# Altium schematic sheet touchscreen.SchDoc
size A
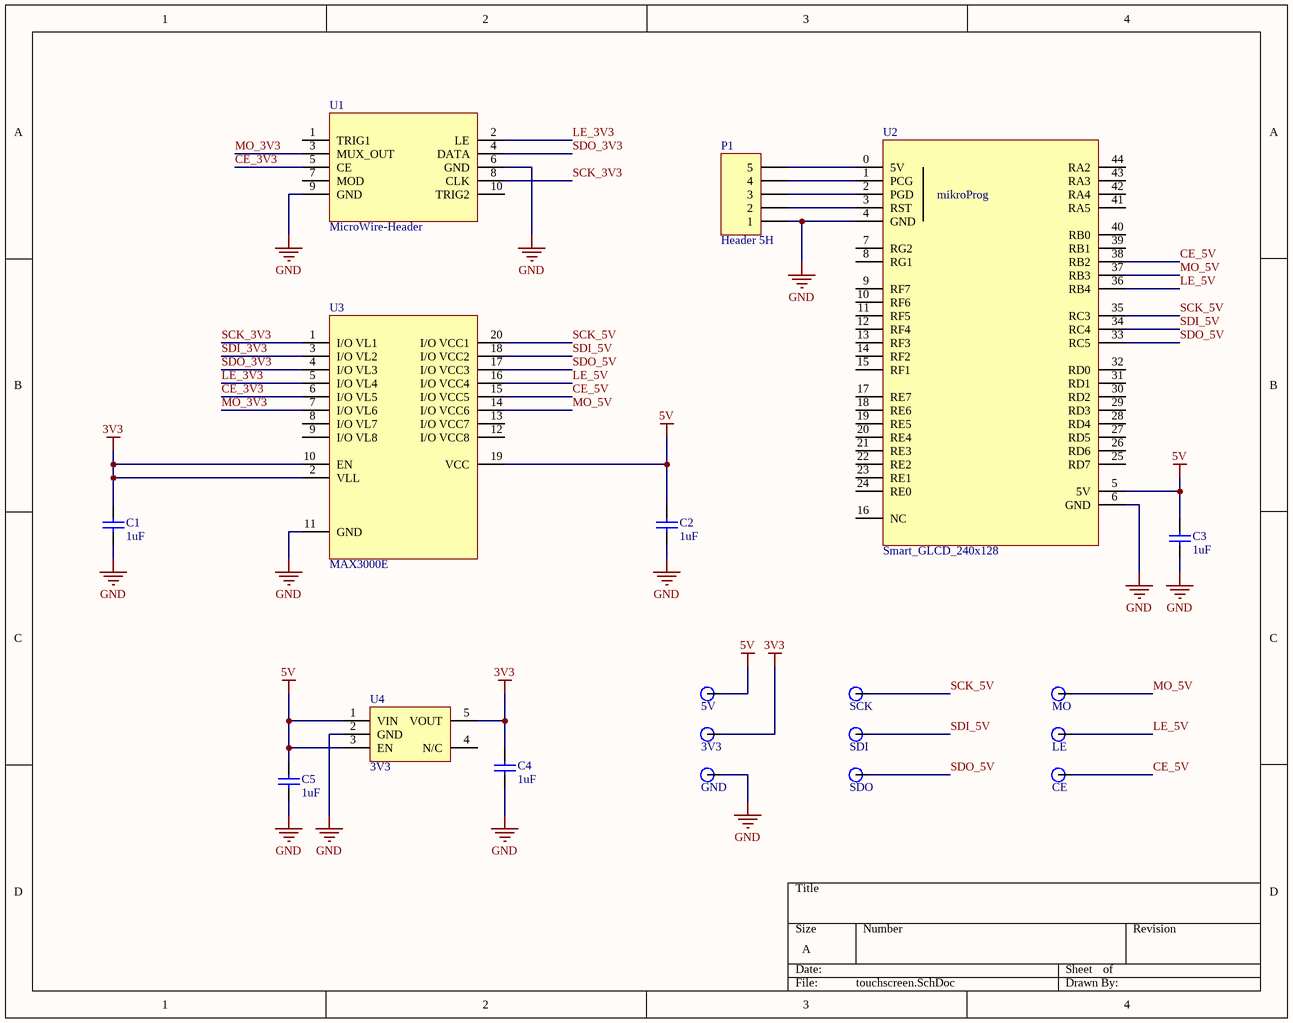
[diagram p0: touchscreen.SchDoc]

## Parts
3V3  TP-LOOP  [TP-LOOP]  (value not drawn)
5V  TP-LOOP  [TP-LOOP]  (value not drawn)
C1  1uF  [0603-0.8MM]
C2  1uF  [0603-0.8MM]
C3  1uF  [0603-0.8MM]
C4  1uF  [0603-0.8MM]
C5  1uF  [0603-0.8MM]
CE  TP-LOOP  [TP-LOOP]  (value not drawn)
GND  TP-LOOP  [TP-LOOP]  (value not drawn)
LE  TP-LOOP  [TP-LOOP]  (value not drawn)
MO  TP-LOOP  [TP-LOOP]  (value not drawn)
P1  Header 5H  [HDR1X5H]
SCK  TP-LOOP  [TP-LOOP]  (value not drawn)
SDI  TP-LOOP  [TP-LOOP]  (value not drawn)
SDO  TP-LOOP  [TP-LOOP]  (value not drawn)
U1  MicroWire-Header  [HDR2x5]
U2  Smart_GLCD_240x128  [GLCD_PANEL]
U3  MAX3000E  [TSSOP20]
U4  3V3  [SOT-23-5]

## Nets
3V3: 3V3.0 C1.2 C4.2 U3.2(VLL) U3.10(EN) U4.5(VOUT)
5V: 5V.0 C2.2 C3.2 C5.2 U2.5(5V) U3.19(VCC) U4.1(VIN) U4.3(EN)
GND: C1.1 C2.1 C3.1 C4.1 C5.1 GND.0 P1.1 U1.6(GND) U1.9(GND) U2.4(GND) U2.6(GND) U3.11(GND) U4.2(GND)
CE_3V3: U1.5(CE) U3.6(I/O_VL5)
CE_5V: CE.0 U2.38(RB2) U3.15(I/O_VCC5)
LE_3V3: U1.2(LE) U3.5(I/O_VL4)
LE_5V: LE.0 U2.36(RB4) U3.16(I/O_VCC4)
MO_3V3: U1.3(MUX_OUT) U3.7(I/O_VL6)
MO_5V: MO.0 U2.37(RB3) U3.14(I/O_VCC6)
SCK_3V3: U1.8(CLK) U3.1(I/O_VL1)
SCK_5V: SCK.0 U2.35(RC3) U3.20(I/O_VCC1)
SDI_3V3: U3.3(I/O_VL2)
SDI_5V: SDI.0 U2.34(RC4) U3.18(I/O_VCC2)
SDO_3V3: U1.4(DATA) U3.4(I/O_VL3)
SDO_5V: SDO.0 U2.33(RC5) U3.17(I/O_VCC3)
NetP1_2: P1.2 U2.3(RST)
NetP1_3: P1.3 U2.2(PGD)
NetP1_4: P1.4 U2.1(PCG)
NetP1_5: P1.5 U2.0(5V)

Not connected (* = marked no-connect by the designer): U1 1(TRIG1) 7(MOD) 10(TRIG2); U2 7(RG2) 8(RG1) 9(RF7) 10(RF6) 11(RF5) 12(RF4) 13(RF3) 14(RF2) 15(RF1) 16(NC) 17(RE7) 18(RE6) 19(RE5) 20(RE4) 21(RE3) 22(RE2) 23(RE1) 24(RE0) 25(RD7) 26(RD6) 27(RD5) 28(RD4) 29(RD3) 30(RD2) 31(RD1) 32(RD0) 39(RB1) 40(RB0) 41(RA5) 42(RA4) 43(RA3) 44(RA2); U3 8(I/O_VL7) 9(I/O_VL8) 12(I/O_VCC8) 13(I/O_VCC7); U4 4(N/C)

## Notes on the sheet
- (in symbol MISCP-00001) mikroProg

## Library data of the parts
3V3 5V = TP-00001: Part Description: Red Test Loop; Manufacturer: Keystone Electronics; Mfg Part Num: 5000; Part Number: TP-00001; Value: TP-LOOP; Pins: 1; Supplier 1: Mouser; Supplier Part Num 1: 534-5000; Supplier Link 1: http://www.mouser.com/ProductDetail/Keystone-Electronics/5000/?qs=sGAEpiMZZMtzcnMBgC2bs9AdrKY7Wm7fC3CU8Xg0kAY%3d
C1-C5 = CAP-00003: Capacitor; Part Description: CAP CER 1UF 50V 10% X7R 0603; Manufacturer: Taiyo Yuden; Mfg Part Num: UMK107AB7105KA-T; Voltage: 50V; Temperature Rating (C): 125; PackageDescription: Chip Capacitor; Part Number: CAP-00003; Value: 1uF; Datasheet Link: http://www.digikey.com/product-detail/en/UMK107AB7105KA-T/587-3247-1-ND/3660107; Supplier 1: Digi-Key; Supplier Part Num 1: 587-3247-1-ND; Supplier Link 1: http://www.digikey.com/product-detail/en/UMK107AB7105KA-T/587-3247-1-ND/3660107
CE LE MO SCK SDI SDO = TP-00005: Part Description: Yellow Test Loop; Manufacturer: Keystone Electronics; Mfg Part Num: 5004; Part Number: TP-00005; Value: TP-LOOP; Pins: 1; Supplier 1: Mouser; Supplier Part Num 1: 534-5004; Supplier Link 1: http://www.mouser.com/ProductDetail/Keystone-Electronics/5004/?qs=%2fha2pyFaduhjVE6EQorYz%252bLTusWZAa7R0fi5DgNOeBY%3d
GND = TP-00002: Part Description: Black Test Loop; Manufacturer: Keystone Electronics; Mfg Part Num: 5001; Part Number: TP-00002; Value: TP-LOOP; Pins: 1; Supplier 1: Digi-Key; Supplier Part Num 1: 5001K-ND; Supplier Link 1: http://www.digikey.com/product-search/en?x=27&y=11&lang=en&site=us&keywords=5001K-ND; Supplier 2: Mouser; Supplier Part Num 2: 534-5001; Supplier Link 2: http://www.mouser.com/ProductDetail/Keystone-Electronics/5001/?qs=%2fha2pyFadugenAX7QbWVFH4SHo0ei47vvMiPqT82XGoPZE5igKcT0vifsSD7Qb20
P1 = CON-00002: Header, 5-Pin, Right Angle; Part Description: 5-Pin 0.1" Right Angle Header; Manufacturer: 3M; Value: 961105-5604-AR; LatestRevisionDate: 17-Jul-2002; LatestRevisionNote: Re-released for DXP Platform.; Publisher: Altium Limited; Part Number: CON-00002; Pins: 5; Mfg Part Num: 961105-5604-AR; Supplier 1: Digi-Key; Supplier Part Num 1: 3M9470-ND
U1 = CON-00001: Part Description: 100 Mil Pitch 2X5 Shrouded Header; Manufacturer: FCI; Mfg Part Num: 52601-G10-8LF; Value: NA; Part Number: CON-00001; Pins: 10; Supplier 1: Digikey; Supplier Part Num 1: 609-3596-ND; Supplier Link 1: http://www.digikey.com/product-detail/en/52601-G10-8LF/609-3596-ND/1487644
U2 = MISCP-00001: Part Description: GLCD Touchscreen Panel; Manufacturer: Mikroelektronika; Mfg Part Num: Smart GLCD 240x128; Value: NA; Voltage: 5; Part Number: MISCP-00001; Operating Temp (°C): NA; Datasheet Link: http://www.mikroe.com/smartglcd/
U3 = MISC-00001: Part Description: Bidirectional 8-Channel Logic Translator; Manufacturer: Maxim Integrated; Mfg Part Num: MAX3000EEUP+; Voltage: 1.65V - 5.5V; Interface: NA; Part Number: MISC-00001; Value: MAX3000E; Operating Temp (°C): 85; Package: 20-TSSOP; Datasheet Link: http://datasheets.maximintegrated.com/en/ds/MAX3000E-MAX3012.pdf; Supplier 1: Digikey; Supplier Part Num 1: MAX3000EEUP+-ND; Supplier Link 1: http://www.digikey.com/product-detail/en/MAX3000EEUP%2B/MAX3000EEUP%2B-ND/1512964
U4 = VREG-00002: Part Description: IC REG LDO 3.3V 0.3A SOT23-5; Manufacturer: TI; Value: TLV70233; Input Voltage: 2.0-5.5V; Fixed/Adjustable: Fixed; Output Voltage: 3.3V; Part Number: VREG-00002; Type: Linear; Operating Temp (°C): 125; Mfg Part Num: TLV70233DBVR; Datasheet Link: http://www.ti.com/lit/ds/symlink/tlv70225.pdf; Supplier 1: Digi-Key; Supplier Part Num 1: 296-32415-1-ND; Supplier Link 1: http://www.digikey.com/product-detail/en/TLV70233DBVR/296-32415-1-ND/3505572; Supplier 2: Mouser; Supplier Part Num 2: 595-TLV70233DBVR; Supplier Link 2: http://www.mouser.com/ProductDetail/Texas-Instruments/TLV70233DBVR/?qs=zQ2yIHQ6k3wiHrD0NUI05Q==